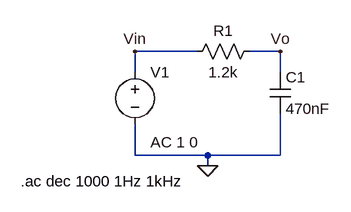
[diagram p0: schematic f_antialias_interpolacion.asc]
f_antialias_interpolacion.asc, the LTspice schematic file:
Version 4.1
SHEET 1 880 680
WIRE 160 128 64 128
WIRE 288 128 240 128
WIRE 64 160 64 128
WIRE 288 160 288 128
WIRE 64 288 64 240
WIRE 176 288 64 288
WIRE 288 288 288 224
WIRE 288 288 176 288
WIRE 176 304 176 288
FLAG 176 304 0
FLAG 64 128 Vin
FLAG 288 128 Vo
SYMBOL res 256 112 R90
WINDOW 0 0 56 VBottom 2
WINDOW 3 32 56 VTop 2
SYMATTR InstName R1
SYMATTR Value 1.2k
SYMBOL cap 272 160 R0
SYMATTR InstName C1
SYMATTR Value 470nF
SYMBOL voltage 64 144 R0
WINDOW 123 24 124 Left 2
WINDOW 39 0 0 Left 0
SYMATTR InstName V1
SYMATTR Value ""
SYMATTR Value2 AC 1 0
TEXT -112 328 Left 2 !.ac dec 1000 1Hz 1kHz

The netlist it stands for:
* f_antialias_interpolacion.asc
R1 Vo Vin 1.2k
C1 Vo 0 470nF
V1 Vin 0 AC 1 0
.ac dec 1000 1Hz 1kHz
.backanno
.end